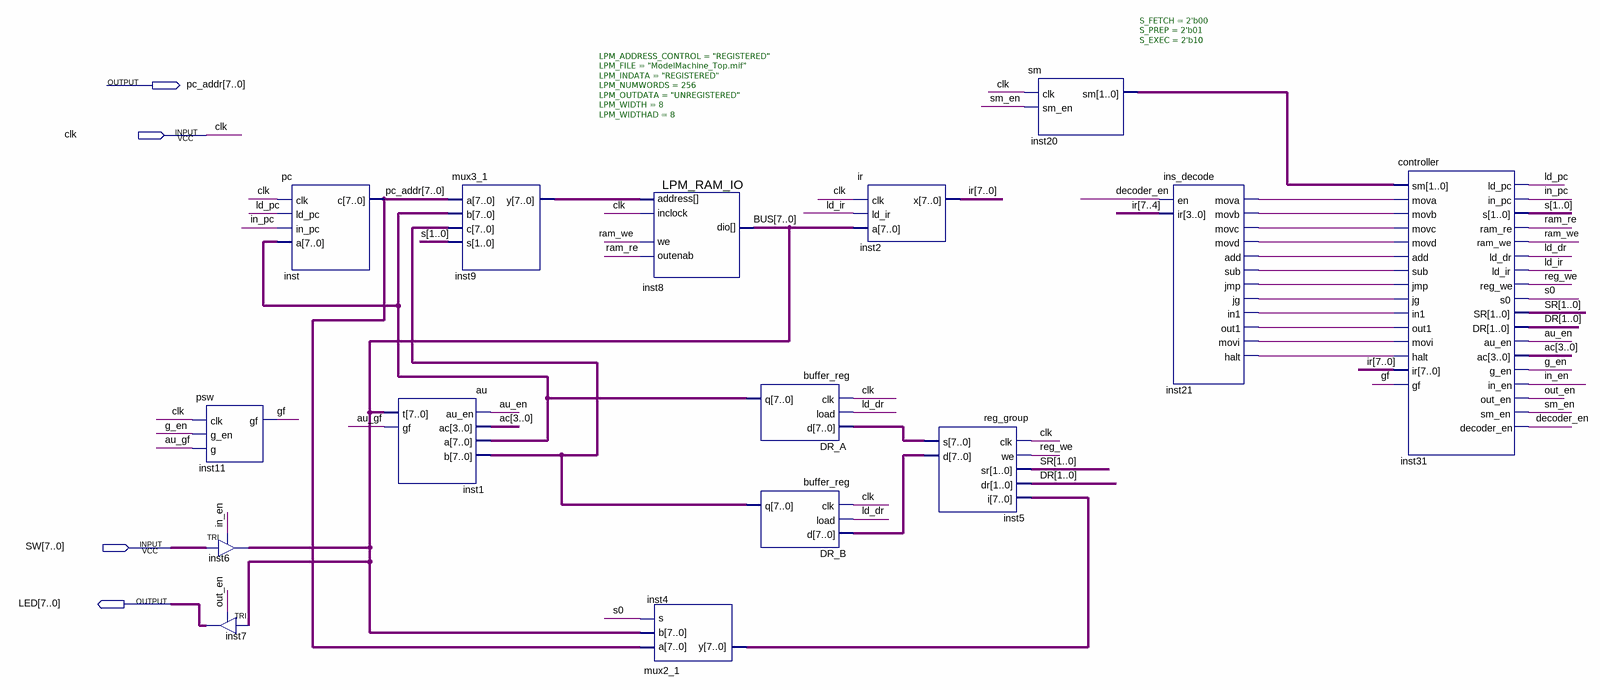
[diagram p0: schematic sheet]
// Quartus schematic ModelMachine_Top.bdf as structural Verilog: 15 symbols, 4 pins
module ModelMachine_Top (
  input  clk,
  input  [7:0] SW,
  output [7:0] pc_addr,
  output [7:0] LED
);

  wire au_en, au_gf, decoder_en, g_en, gf, in_en, in_pc, inst21_add, inst21_halt, inst21_in1, inst21_jg,
       inst21_jmp, inst21_mova, inst21_movb, inst21_movc, inst21_movd, inst21_movi, inst21_out1, inst21_sub,
       ld_dr, ld_ir, ld_pc, out_en, ram_re, ram_we, reg_we, sm_en;
  wire [1:0] DR, inst20_sm, s, SR;
  wire [3:0] ac;
  wire [7:0] BUS, DR_A_q, DR_B_q, inst4_y, inst5_d, inst5_s, inst9_y, ir;

  psw inst11 (.clk(clk), .g_en(g_en), .g(au_gf), .gf(gf));
  TRI inst6[7:0] (.IN(SW), .OE(in_en), .OUT(BUS));
  TRI inst7[7:0] (.IN(BUS), .OE(out_en), .OUT(LED));
  pc inst (.clk(clk), .ld_pc(ld_pc), .in_pc(in_pc), .a(DR_A_q), .c(pc_addr));
  au inst1 (.au_en(au_en), .ac(ac), .a(DR_A_q), .b(DR_B_q), .t(BUS), .gf(au_gf));
  mux3_1 inst9 (.a(pc_addr), .b(DR_A_q), .c(DR_B_q), .s(s), .y(inst9_y));
  LPM_RAM_IO #(.LPM_ADDRESS_CONTROL("REGISTERED"), .LPM_FILE("ModelMachine_Top.mif"), .LPM_INDATA("REGISTERED"), .LPM_NUMWORDS(256), .LPM_OUTDATA("UNREGISTERED"), .LPM_WIDTH(8), .LPM_WIDTHAD(8)) inst8 (
    .address(inst9_y), .inclock(clk), .we(ram_we), .outenab(ram_re), .dio(BUS));
  mux2_1 inst4 (.a(pc_addr), .b(BUS), .s(s[0]), .y(inst4_y));
  buffer_reg DR_A (.clk(clk), .load(ld_dr), .d(inst5_s), .q(DR_A_q));
  buffer_reg DR_B (.clk(clk), .load(ld_dr), .d(inst5_d), .q(DR_B_q));
  ir inst2 (.clk(clk), .ld_ir(ld_ir), .a(BUS), .x(ir));
  reg_group inst5 (.clk(clk), .we(reg_we), .sr(SR), .dr(DR), .i(inst4_y), .s(inst5_s), .d(inst5_d));
  sm #(.S_FETCH(2'b00), .S_PREP(2'b01), .S_EXEC(2'b10)) inst20 (.clk(clk), .sm_en(sm_en), .sm(inst20_sm));
  ins_decode inst21 (
    .en(decoder_en), .ir(ir[7:4]), .mova(inst21_mova), .movb(inst21_movb), .movc(inst21_movc),
    .movd(inst21_movd), .add(inst21_add), .sub(inst21_sub), .jmp(inst21_jmp), .jg(inst21_jg),
    .in1(inst21_in1), .out1(inst21_out1), .movi(inst21_movi), .halt(inst21_halt));
  controller inst31 (
    .sm(inst20_sm), .mova(inst21_mova), .movb(inst21_movb), .movc(inst21_movc), .movd(inst21_movd),
    .add(inst21_add), .sub(inst21_sub), .jmp(inst21_jmp), .jg(inst21_jg), .in1(inst21_in1),
    .out1(inst21_out1), .movi(inst21_movi), .halt(inst21_halt), .ir(ir), .gf(gf), .ld_pc(ld_pc),
    .in_pc(in_pc), .s(s), .ram_re(ram_re), .ram_we(ram_we), .ld_dr(ld_dr), .ld_ir(ld_ir), .reg_we(reg_we),
    .s0(s[0]), .SR(SR), .DR(DR), .au_en(au_en), .ac(ac), .g_en(g_en), .in_en(in_en), .out_en(out_en),
    .sm_en(sm_en), .decoder_en(decoder_en));
endmodule
